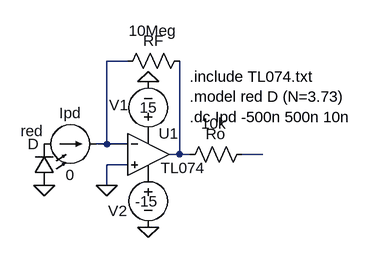
[diagram p0: schematic 4.4.1.circuit.asc]
4.4.1.circuit.asc, the LTspice schematic file:
Version 4
SHEET 1 880 680
WIRE 240 176 208 176
WIRE 208 304 208 176
WIRE 208 304 192 304
WIRE 240 304 208 304
WIRE 320 320 320 176
WIRE 320 320 304 320
WIRE 336 320 320 320
WIRE 448 320 416 320
WIRE 240 336 208 336
WIRE 208 368 208 336
FLAG 112 368 0
FLAG 208 368 0
FLAG 272 208 0
FLAG 272 432 0
SYMBOL opamp2 272 256 R0
WINDOW 3 19 85 Left 2
SYMATTR Value TL074
SYMATTR InstName U1
SYMBOL LED 128 368 R180
WINDOW 0 24 64 Left 2
WINDOW 3 17 84 Left 2
SYMATTR InstName D
SYMATTR Value red
SYMBOL Res 336 160 R90
WINDOW 0 0 56 VBottom 2
WINDOW 3 -46 57 VTop 2
SYMATTR InstName RF
SYMATTR Value 10Meg
SYMBOL Res 432 304 R90
WINDOW 0 0 56 VBottom 2
WINDOW 3 -47 59 VTop 2
SYMATTR InstName Ro
SYMATTR Value 10k
SYMBOL current 112 304 R270
WINDOW 0 32 40 VTop 2
WINDOW 3 -32 40 VBottom 2
SYMATTR InstName Ipd
SYMATTR Value 0
SYMBOL Voltage 272 304 R180
WINDOW 0 31 60 Left 2
WINDOW 3 -14 56 Left 2
SYMATTR InstName V1
SYMATTR Value 15
SYMBOL Voltage 272 336 R0
WINDOW 0 -62 71 Left 2
WINDOW 3 -20 56 Left 2
SYMATTR InstName V2
SYMATTR Value -15
TEXT 336 200 Left 2 !.include TL074.txt\n.model red D (N=3.73)\n.dc Ipd -500n 500n 10n

The netlist it stands for:
* 4.4.1.circuit.asc
XU1 0 N001 P001 P002 N002 TL074  ; pins In+ In- V+ V- OUT
D 0 P003 red
RF N002 N001 10Meg
Ro N003 N002 10k
Ipd P003 N001 0
V1 P001 0 15
V2 P002 0 -15
.model D D
.lib standard.dio
.include TL074.txt
.model red D (N=3.73)
.dc Ipd -500n 500n 10n
.backanno
.end